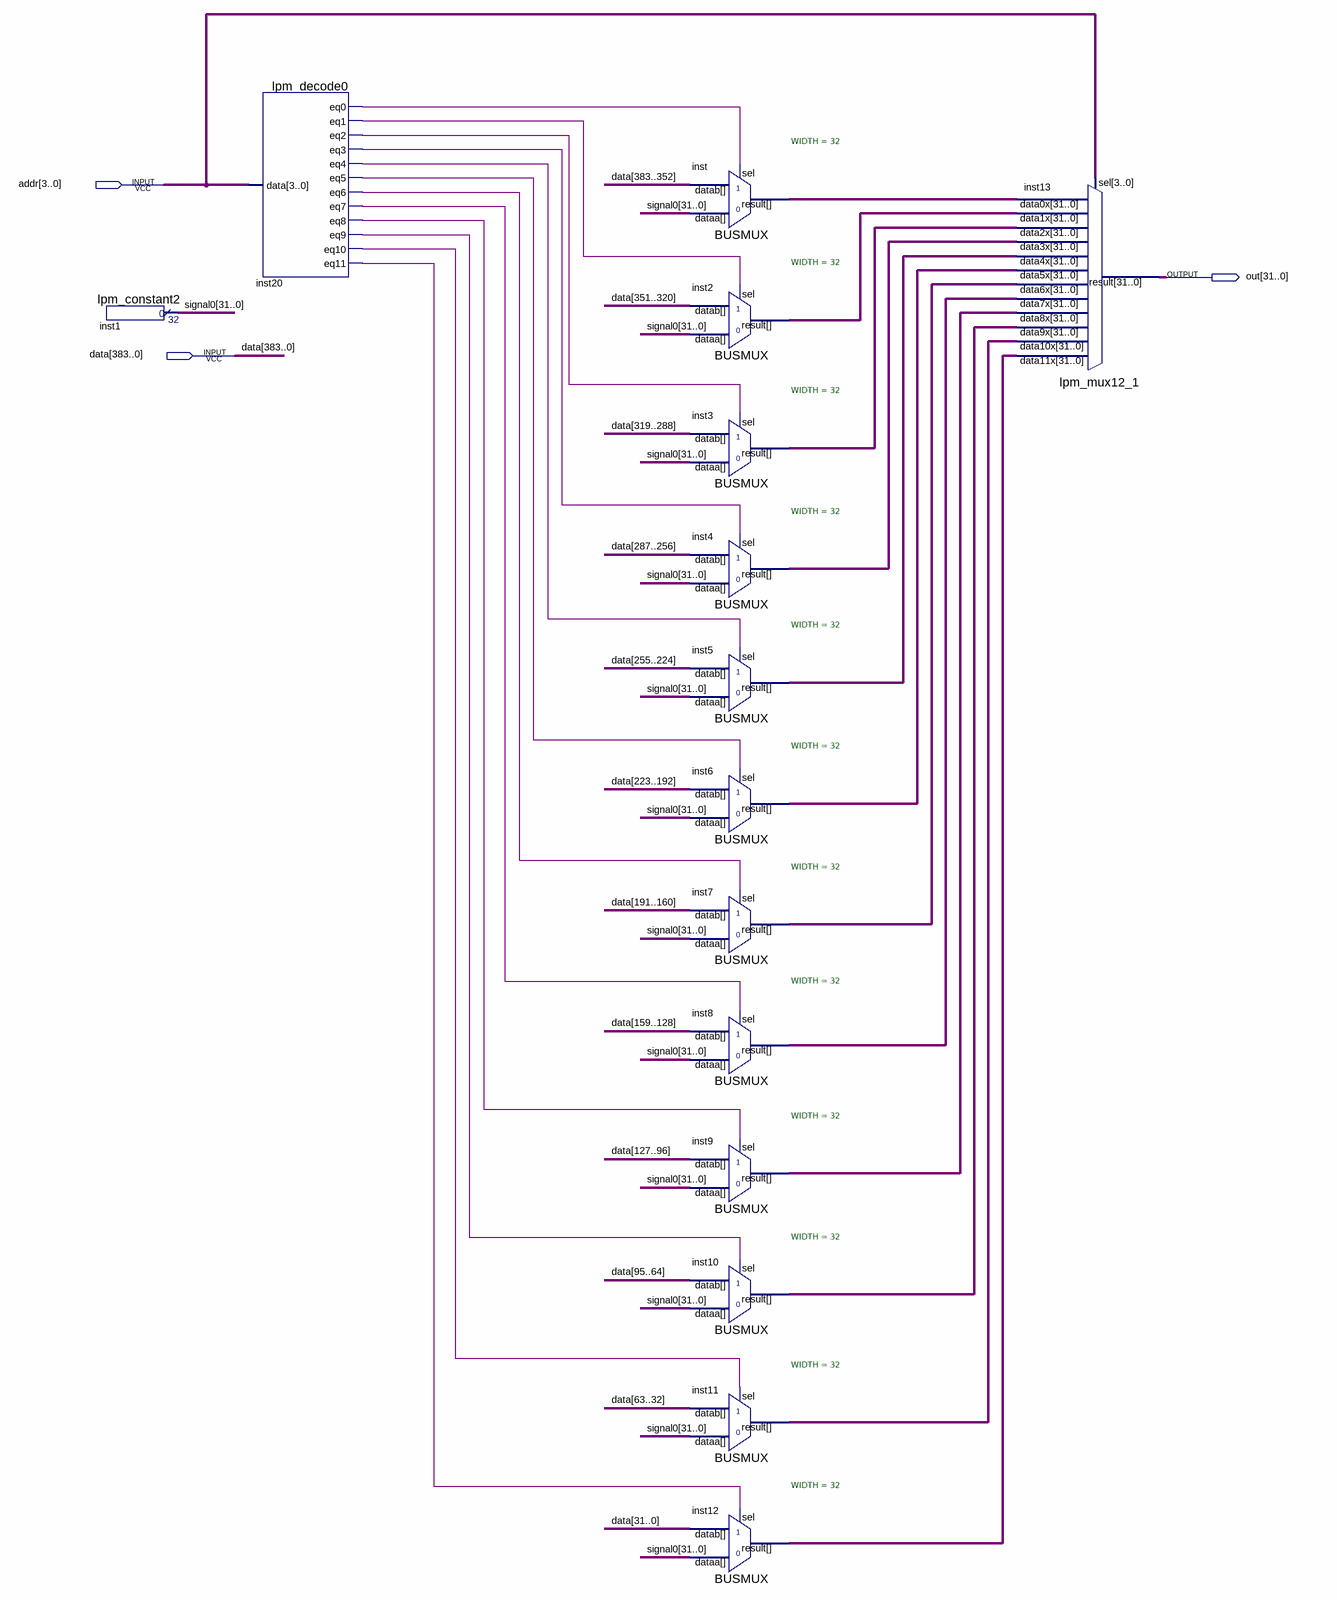
[diagram p0: schematic sheet]
// Quartus schematic demux.bdf as structural Verilog: 15 symbols, 3 pins
module demux (
  input  [3:0] addr,
  input  [383:0] data,
  output [31:0] out
);

  wire inst20_eq0, inst20_eq1, inst20_eq2, inst20_eq3, inst20_eq4, inst20_eq5, inst20_eq6, inst20_eq7,
       inst20_eq8, inst20_eq9, inst20_eq10, inst20_eq11;
  wire [31:0] inst2_result, inst3_result, inst4_result, inst5_result, inst6_result, inst7_result,
       inst8_result, inst9_result, inst10_result, inst11_result, inst12_result, inst_result, signal0;

  lpm_constant2 inst1 (.result(signal0));
  lpm_decode0 inst20 (
    .data(addr), .eq0(inst20_eq0), .eq1(inst20_eq1), .eq2(inst20_eq2), .eq3(inst20_eq3), .eq4(inst20_eq4),
    .eq5(inst20_eq5), .eq6(inst20_eq6), .eq7(inst20_eq7), .eq8(inst20_eq8), .eq9(inst20_eq9),
    .eq10(inst20_eq10), .eq11(inst20_eq11));
  BUSMUX #(.WIDTH(32)) inst (.datab(data[383:352]), .sel(inst20_eq0), .dataa(signal0), .result(inst_result));
  BUSMUX #(.WIDTH(32)) inst2 (.datab(data[351:320]), .sel(inst20_eq1), .dataa(signal0), .result(inst2_result));
  BUSMUX #(.WIDTH(32)) inst3 (.datab(data[319:288]), .sel(inst20_eq2), .dataa(signal0), .result(inst3_result));
  BUSMUX #(.WIDTH(32)) inst4 (.datab(data[287:256]), .sel(inst20_eq3), .dataa(signal0), .result(inst4_result));
  BUSMUX #(.WIDTH(32)) inst5 (.datab(data[255:224]), .sel(inst20_eq4), .dataa(signal0), .result(inst5_result));
  BUSMUX #(.WIDTH(32)) inst6 (.datab(data[223:192]), .sel(inst20_eq5), .dataa(signal0), .result(inst6_result));
  BUSMUX #(.WIDTH(32)) inst7 (.datab(data[191:160]), .sel(inst20_eq6), .dataa(signal0), .result(inst7_result));
  BUSMUX #(.WIDTH(32)) inst8 (.datab(data[159:128]), .sel(inst20_eq7), .dataa(signal0), .result(inst8_result));
  BUSMUX #(.WIDTH(32)) inst9 (.datab(data[127:96]), .sel(inst20_eq8), .dataa(signal0), .result(inst9_result));
  BUSMUX #(.WIDTH(32)) inst10 (.datab(data[95:64]), .sel(inst20_eq9), .dataa(signal0), .result(inst10_result));
  BUSMUX #(.WIDTH(32)) inst11 (.datab(data[63:32]), .sel(inst20_eq10), .dataa(signal0), .result(inst11_result));
  BUSMUX #(.WIDTH(32)) inst12 (.datab(data[31:0]), .sel(inst20_eq11), .dataa(signal0), .result(inst12_result));
  lpm_mux12_1 inst13 (
    .data11x(inst12_result), .data10x(inst11_result), .data9x(inst10_result), .data8x(inst9_result),
    .data7x(inst8_result), .data6x(inst7_result), .data5x(inst6_result), .data4x(inst5_result),
    .data3x(inst4_result), .data2x(inst3_result), .data1x(inst2_result), .data0x(inst_result), .sel(addr),
    .result(out));
endmodule
